# Altium schematic sheet pwm-sg3525a.SchDoc
size A3; Organization: Protel International P/L; Address1: L3, 12a Rodborough Rd; Address2: Frenchs Forest; Address3: NSW; Address4: Australia 2086
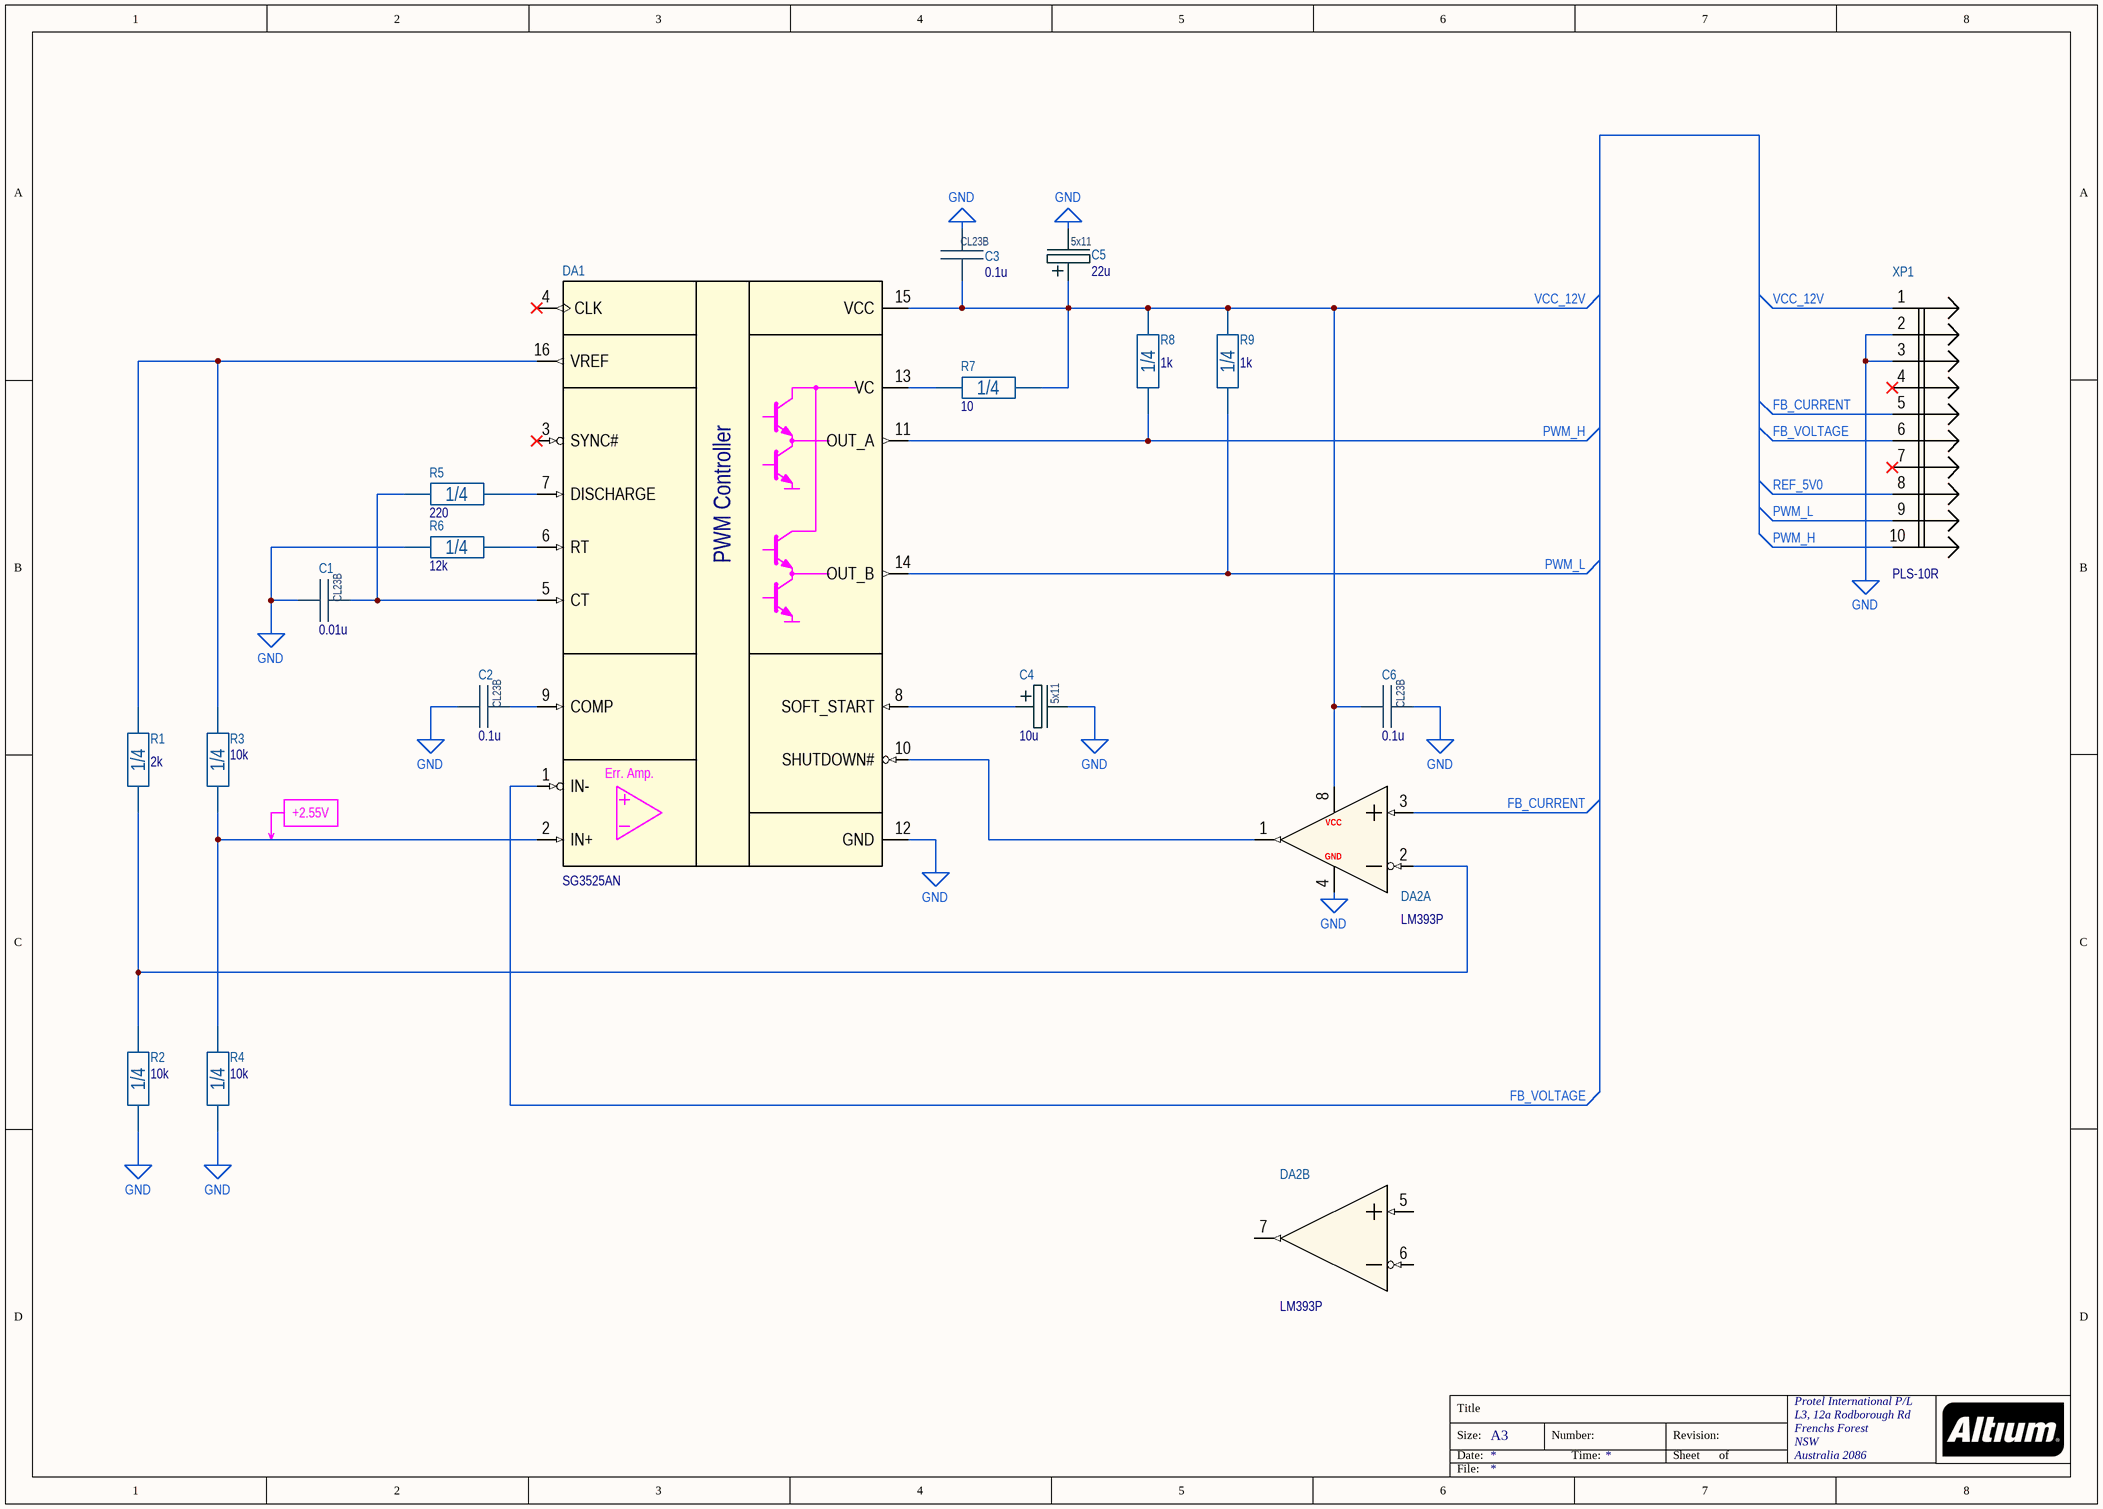
[diagram p0: pwm-sg3525a.SchDoc]

## Parts
C1  0.01u  [CL23B_7.2x2.5]
C2  0.1u  [CL23B_7.2x2.5]
C3  0.1u  [CL23B_7.2x2.5]
C4  10u  Package: 5x11  [ECAP5X11X2.0_BRW]
C5  22u  Package: 5x11  [ECAP5X11X2.0_BRW]
C6  0.1u  [CL23B_7.2x2.5]
DA1  SG3525AN  [DIP-16P-M03]
DA2  LM393P  [DIP-8P-M01_with_SO8]  (parts A,B of 2)
R1  2k  Package: 1/4  [CFR-25]
R2  10k  Package: 1/4  [CFR-25(VERTICAL)]
R3  10k  Package: 1/4  [CFR-25(VERTICAL)]
R4  10k  Package: 1/4  [CFR-25(VERTICAL)]
R5  220  Package: 1/4  [CFR-25(VERTICAL)]
R6  12k  Package: 1/4  [CFR-25(VERTICAL)]
R7  10  Package: 1/4  [CFR-25(VERTICAL)]
R8  1k  Package: 1/4  [CFR-25(VERTICAL)]
R9  1k  Package: 1/4  [CFR-25(VERTICAL)]
XP1  PLS-10R  [PLS-10R]

## Nets
GND: C1.2 C2.2 C3.1 C4.2 C5.2 C6.2 DA1.12(GND) DA2.4(GND) R2.1 R4.1 R6.2 XP1.2 XP1.3
FB_CURRENT: DA2.3(1IN+) XP1.5
FB_VOLTAGE: DA1.1(IN-) XP1.6
PWM_H: DA1.11(OUT_A) R8.2 XP1.10
PWM_L: DA1.14(OUT_B) R9.2 XP1.9
REF_5V0: XP1.8
VCC_12V: C3.2 C5.1 C6.1 DA1.15(VCC) DA2.8(VCC) R7.1 R8.1 R9.1 XP1.1
NetC1_1: C1.1 DA1.5(CT) R5.2
NetC2_1: C2.1 DA1.9(COMP)
NetC4_1: C4.1 DA1.8(SOFT_START)
NetDA1_2: DA1.2(IN+) R3.1 R4.2
NetDA1_6: DA1.6(RT) R6.1
NetDA1_7: DA1.7(DISCHARGE) R5.1
NetDA1_10: DA1.10(SHUTDOWN#) DA2.1(1OUT)
NetDA1_13: DA1.13(VC) R7.2
NetDA1_16: DA1.16(VREF) R1.1 R3.2
NetDA2_2: DA2.2(1IN-) R1.2 R2.2

Not connected (* = marked no-connect by the designer): DA1 3(SYNC#)* 4(CLK)*; DA2 5(2IN+) 6(2IN-) 7(2OUT); XP1 4* 7*

## Notes on the sheet
- +2.55V
- Title
- Size:
- Date:
- A3
- Number:
- Time:
- Revision:
- Sheet
- of
- File:
- (in symbol SG3525AN) PWM Controller; Err. Amp.

## Library data of the parts
C1-C3 C6 = CL23B: Box-type metallized polyester film capacitor; Tolerance: ± * %; Voltage: 63V; Dielectric: Polyester; Part Number: *; Manufacturer: *; Package: CL23B
  C1: Value: 0.01u; Value on schem: 0.01u
  C2 C3 C6: Value: 0.1u; Value on schem: 0.1u
C4 = C_ECAP: Aluminium capacitor; Part Number: UVR1E100MDD1TD; Manufacturer: Nichicon; Tolerance: ± 20 %; Voltage: 25V; Value: 10u; Value on schem: 10u
C5 = C_ECAP: Aluminium capacitor; Part Number: UVR1J220MDD; Manufacturer: Nichicon; Tolerance: ± 20 %; Voltage: 63V; Value: 22u; Value on schem: 22u
DA1 = SG3525AN: Pulse-Width-Modulation Control Circuits; Manufacturer: ON Semiconductor; Part Number: SG3525AN; Package: DIP-16
DA2 = LM393P: Dual Comparator; Manufacturer: Texas Instruments; Part Number: LM393P; Package: DIP-8
R1 = CF25: Resistor 1/4W; Part Number: MFR-25FTF52-2K; Manufacturer: Yageo; Tolerance: ± 1 %; Voltage: 250V; Temperature Coefficient: ±100 ppm/°C; Value: 2k; Value on schem: 2k
R2-R4 = CF25: Resistor 1/4W; Part Number: MFR-25FTF52-10K; Manufacturer: Yageo; Tolerance: ± 1 %; Voltage: 250V; Temperature Coefficient: ±100 ppm/°C; Value: 10k; Value on schem: 10k
R5 = CF25: Resistor 1/4W; Part Number: MFR-25FTF52-220R; Manufacturer: Yageo; Tolerance: ± 1 %; Voltage: 250V; Temperature Coefficient: ±100 ppm/°C; Value: 220; Value on schem: 220
R6 = CF25: Resistor 1/4W; Part Number: MFR-25FTF52-12K; Manufacturer: Yageo; Tolerance: ± 1 %; Voltage: 250V; Temperature Coefficient: ±100 ppm/°C; Value: 12k; Value on schem: 12k
R7 = CF25: Resistor 1/4W; Part Number: MFR-25FTF52-10R; Manufacturer: Yageo; Tolerance: ± 1 %; Voltage: 250V; Temperature Coefficient: ±100 ppm/°C; Value: 10; Value on schem: 10
R8 R9 = CF25: Resistor 1/4W; Part Number: MFR-25FTF52-1K; Manufacturer: Yageo; Tolerance: ± 1 %; Voltage: 250V; Temperature Coefficient: ±100 ppm/°C; Value: 1k; Value on schem: 1k
XP1 = PLS-10R: Value: PLS-10R